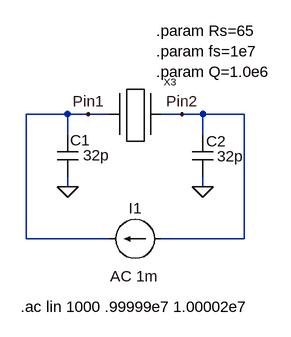
[diagram p0: schematic 08_CrystalSymbolInParallelResonance2.asc]
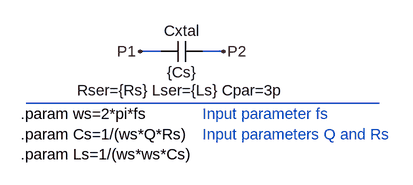
[diagram p1: sub-circuit xtal_param.asc]
08_CrystalSymbolInParallelResonance2.asc, the LTspice schematic file:
Version 4
SHEET 1 880 680
WIRE 160 128 96 128
WIRE 192 128 160 128
WIRE 224 128 192 128
WIRE 336 128 304 128
WIRE 368 128 336 128
WIRE 432 128 368 128
WIRE 160 160 160 128
WIRE 368 160 368 128
WIRE 160 240 160 224
WIRE 368 240 368 224
WIRE 96 320 96 128
WIRE 224 320 96 320
WIRE 432 320 432 128
WIRE 432 320 304 320
FLAG 160 240 0
FLAG 368 240 0
FLAG 192 128 Pin1
FLAG 336 128 Pin2
SYMBOL cap 144 160 R0
WINDOW 0 20 8 Left 0
WINDOW 3 40 31 Left 0
SYMATTR InstName C1
SYMATTR Value 32p
SYMBOL cap 352 160 R0
WINDOW 0 21 10 Left 0
WINDOW 3 38 33 Left 0
SYMATTR InstName C2
SYMATTR Value 32p
SYMBOL xtal_param 224 160 R0
SYMATTR InstName X3
SYMBOL current 304 320 R90
WINDOW 0 -32 40 VBottom 0
WINDOW 3 32 40 VTop 0
WINDOW 123 42 42 VTop 0
WINDOW 39 0 0 Left 0
SYMATTR InstName I1
SYMATTR Value ""
SYMATTR Value2 AC 1m
TEXT 296 0 Left 0 !.param Rs=65\n.param fs=1e7\n.param Q=1.0e6
TEXT 88 424 Left 0 !.ac lin 1000 .99999e7 1.00002e7

xtal_param.asc, the sub-circuit schematic file:
Version 4
SHEET 1 880 680
WIRE 176 144 144 144
WIRE 272 144 240 144
FLAG 144 144 P1
FLAG 272 144 P2
SYMBOL cap 240 128 R90
WINDOW 0 0 32 VBottom 0
WINDOW 3 32 32 VTop 0
WINDOW 39 60 32 VTop 0
SYMATTR InstName Cxtal
SYMATTR Value {Cs}
SYMATTR SpiceLine Rser={Rs} Lser={Ls} Cpar=3p
TEXT -40 240 Left 0 !.param ws=2*pi*fs\n.param Cs=1/(ws*Q*Rs)\n.param Ls=1/(ws*ws*Cs)
TEXT 240 240 Left 0 ;Input parameter fs\nInput parameters Q and Rs
LINE Normal 512 224 -32 224

The netlist it stands for:
* 08_CrystalSymbolInParallelResonance2.asc
C1 Pin1 0 32p
C2 Pin2 0 32p
XX3 Pin1 Pin2 xtal_param
I1 Pin2 Pin1 AC 1m

* block symbol definitions
.subckt xtal_param P1 P2
Cxtal P2 P1 {Cs} Rser={Rs} Lser={Ls} Cpar=3p
.param ws=2*pi*fs
.param Cs=1/(ws*Q*Rs)
.param Ls=1/(ws*ws*Cs)
* Input parameter fs
* Input parameters Q and Rs
.ends xtal_param

.param Rs=65
.param fs=1e7
.param Q=1.0e6
.ac lin 1000 .99999e7 1.00002e7
.backanno
.end